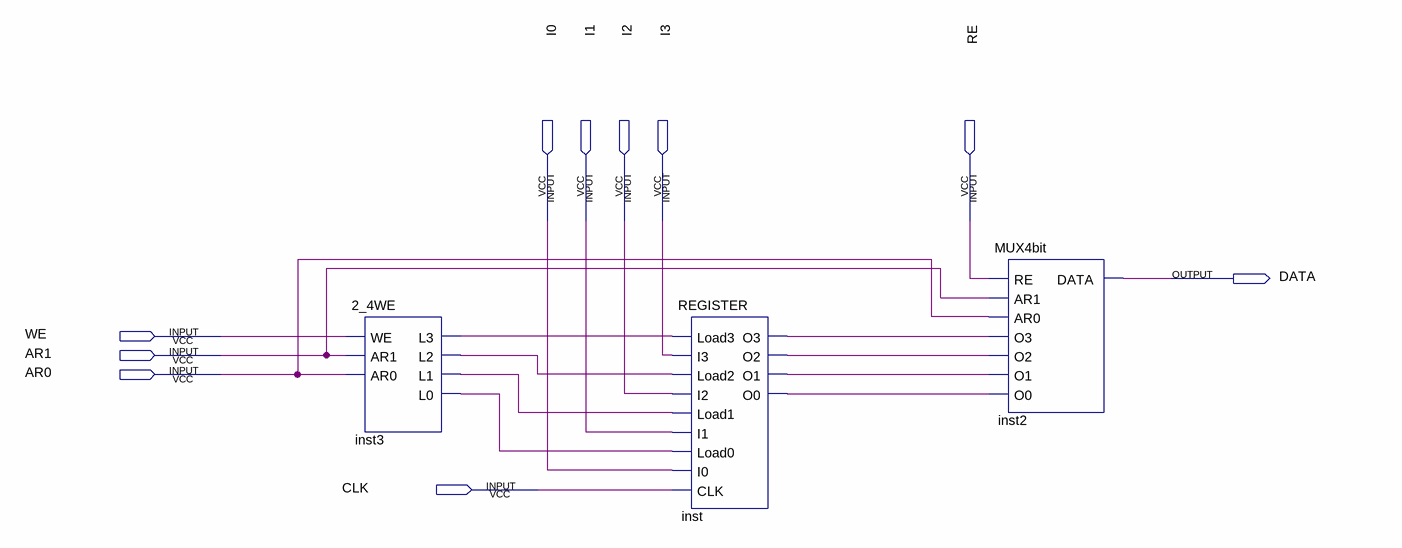
[diagram p0: schematic sheet]
// Quartus schematic Register_File.bdf as structural Verilog: 3 symbols, 10 pins
module Register_File (
  input  I0,
  input  I1,
  input  I2,
  input  I3,
  input  RE,
  input  WE,
  input  AR1,
  input  AR0,
  input  CLK,
  output DATA
);

  wire inst3_l0, inst3_l1, inst3_l2, inst3_l3, inst_o0, inst_o1, inst_o2, inst_o3;

  \2_4WE  inst3 (.WE(WE), .AR1(AR1), .AR0(AR0), .L3(inst3_l3), .L2(inst3_l2), .L1(inst3_l1), .L0(inst3_l0));
  REGISTER inst (
    .Load3(inst3_l3), .I3(I3), .Load2(inst3_l2), .I2(I2), .Load1(inst3_l1), .I1(I1), .Load0(inst3_l0),
    .I0(I0), .CLK(CLK), .O3(inst_o3), .O2(inst_o2), .O1(inst_o1), .O0(inst_o0));
  MUX4bit inst2 (.RE(RE), .AR1(AR1), .AR0(AR0), .O3(inst_o3), .O2(inst_o2), .O1(inst_o1), .O0(inst_o0), .DATA(DATA));
endmodule
